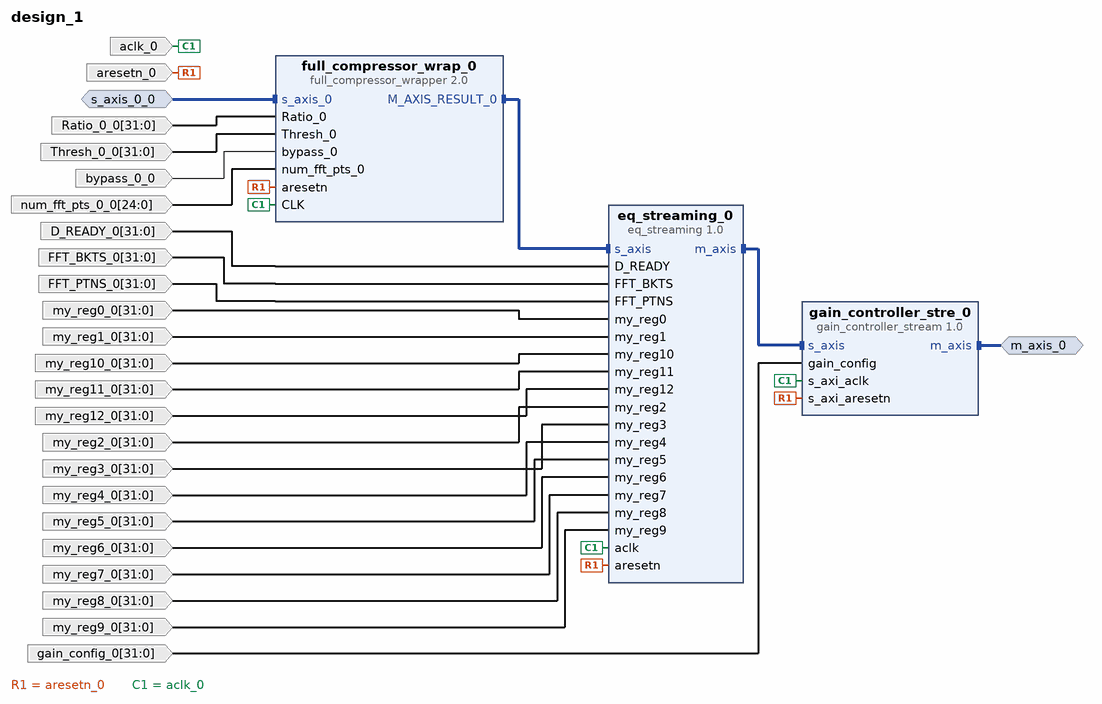
[diagram p0: block diagram of the top level]
# Vivado block design design_1, xc7z020clg484-1, Vivado 2020.2
create_bd_design design_1

create_bd_intf_port -mode Slave -vlnv xilinx.com:interface:axis_rtl:1.0 s_axis_0_0
set_property -dict [list \
  CONFIG.HAS_TKEEP 0 \
  CONFIG.HAS_TLAST 0 \
  CONFIG.HAS_TREADY 1 \
  CONFIG.HAS_TSTRB 0 \
  CONFIG.LAYERED_METADATA undef \
  CONFIG.TDATA_NUM_BYTES 4 \
  CONFIG.TDEST_WIDTH 0 \
  CONFIG.TID_WIDTH 0 \
  CONFIG.TUSER_WIDTH 0 \
] [get_bd_intf_ports s_axis_0_0]
create_bd_intf_port -mode Master -vlnv xilinx.com:interface:axis_rtl:1.0 m_axis_0
create_bd_port -dir I -type rst aresetn_0
create_bd_port -dir I -type clk aclk_0
create_bd_port -dir I -from 31 -to 0 Ratio_0_0
create_bd_port -dir I -from 31 -to 0 Thresh_0_0
create_bd_port -dir I bypass_0_0
create_bd_port -dir I -from 24 -to 0 num_fft_pts_0_0
create_bd_port -dir I -from 31 -to 0 D_READY_0
create_bd_port -dir I -from 31 -to 0 FFT_BKTS_0
create_bd_port -dir I -from 31 -to 0 FFT_PTNS_0
create_bd_port -dir I -from 31 -to 0 my_reg0_0
create_bd_port -dir I -from 31 -to 0 my_reg1_0
create_bd_port -dir I -from 31 -to 0 my_reg10_0
create_bd_port -dir I -from 31 -to 0 my_reg11_0
create_bd_port -dir I -from 31 -to 0 my_reg12_0
create_bd_port -dir I -from 31 -to 0 my_reg2_0
create_bd_port -dir I -from 31 -to 0 my_reg3_0
create_bd_port -dir I -from 31 -to 0 my_reg4_0
create_bd_port -dir I -from 31 -to 0 my_reg5_0
create_bd_port -dir I -from 31 -to 0 my_reg6_0
create_bd_port -dir I -from 31 -to 0 my_reg7_0
create_bd_port -dir I -from 31 -to 0 my_reg8_0
create_bd_port -dir I -from 31 -to 0 my_reg9_0
create_bd_port -dir I -from 31 -to 0 gain_config_0

create_bd_cell -type ip -vlnv sfu.ca:user:full_compressor_wrapper:2.0 full_compressor_wrap_0
create_bd_cell -type ip -vlnv sfu.ca:user:gain_controller_stream:1.0 gain_controller_stre_0
create_bd_cell -type ip -vlnv sfu.ca:user:eq_streaming:1.0 eq_streaming_0

# ---- connections ----

connect_bd_intf_net [get_bd_intf_pins full_compressor_wrap_0/M_AXIS_RESULT_0] [get_bd_intf_pins eq_streaming_0/s_axis]
connect_bd_intf_net [get_bd_intf_pins eq_streaming_0/m_axis] [get_bd_intf_pins gain_controller_stre_0/s_axis]
connect_bd_intf_net -intf_net s_axis_0_0_1 [get_bd_intf_ports s_axis_0_0] [get_bd_intf_pins full_compressor_wrap_0/s_axis_0]
connect_bd_intf_net [get_bd_intf_ports m_axis_0] [get_bd_intf_pins gain_controller_stre_0/m_axis]
connect_bd_net -net aresetn_0_1 [get_bd_ports aresetn_0] \
  [get_bd_pins full_compressor_wrap_0/aresetn] [get_bd_pins gain_controller_stre_0/s_axi_aresetn] \
  [get_bd_pins eq_streaming_0/aresetn]
connect_bd_net -net aclk_0_1 [get_bd_ports aclk_0] \
  [get_bd_pins gain_controller_stre_0/s_axi_aclk] [get_bd_pins full_compressor_wrap_0/CLK] [get_bd_pins eq_streaming_0/aclk]
connect_bd_net -net Ratio_0_0_1 [get_bd_ports Ratio_0_0] [get_bd_pins full_compressor_wrap_0/Ratio_0]
connect_bd_net -net Thresh_0_0_1 [get_bd_ports Thresh_0_0] [get_bd_pins full_compressor_wrap_0/Thresh_0]
connect_bd_net -net bypass_0_0_1 [get_bd_ports bypass_0_0] [get_bd_pins full_compressor_wrap_0/bypass_0]
connect_bd_net -net num_fft_pts_0_0_1 [get_bd_ports num_fft_pts_0_0] [get_bd_pins full_compressor_wrap_0/num_fft_pts_0]
connect_bd_net -net D_READY_0_1 [get_bd_ports D_READY_0] [get_bd_pins eq_streaming_0/D_READY]
connect_bd_net -net FFT_BKTS_0_1 [get_bd_ports FFT_BKTS_0] [get_bd_pins eq_streaming_0/FFT_BKTS]
connect_bd_net -net FFT_PTNS_0_1 [get_bd_ports FFT_PTNS_0] [get_bd_pins eq_streaming_0/FFT_PTNS]
connect_bd_net -net my_reg0_0_1 [get_bd_ports my_reg0_0] [get_bd_pins eq_streaming_0/my_reg0]
connect_bd_net -net my_reg1_0_1 [get_bd_ports my_reg1_0] [get_bd_pins eq_streaming_0/my_reg1]
connect_bd_net -net my_reg10_0_1 [get_bd_ports my_reg10_0] [get_bd_pins eq_streaming_0/my_reg10]
connect_bd_net -net my_reg11_0_1 [get_bd_ports my_reg11_0] [get_bd_pins eq_streaming_0/my_reg11]
connect_bd_net -net my_reg12_0_1 [get_bd_ports my_reg12_0] [get_bd_pins eq_streaming_0/my_reg12]
connect_bd_net -net my_reg2_0_1 [get_bd_ports my_reg2_0] [get_bd_pins eq_streaming_0/my_reg2]
connect_bd_net -net my_reg3_0_1 [get_bd_ports my_reg3_0] [get_bd_pins eq_streaming_0/my_reg3]
connect_bd_net -net my_reg4_0_1 [get_bd_ports my_reg4_0] [get_bd_pins eq_streaming_0/my_reg4]
connect_bd_net -net my_reg5_0_1 [get_bd_ports my_reg5_0] [get_bd_pins eq_streaming_0/my_reg5]
connect_bd_net -net my_reg6_0_1 [get_bd_ports my_reg6_0] [get_bd_pins eq_streaming_0/my_reg6]
connect_bd_net -net my_reg7_0_1 [get_bd_ports my_reg7_0] [get_bd_pins eq_streaming_0/my_reg7]
connect_bd_net -net my_reg8_0_1 [get_bd_ports my_reg8_0] [get_bd_pins eq_streaming_0/my_reg8]
connect_bd_net -net my_reg9_0_1 [get_bd_ports my_reg9_0] [get_bd_pins eq_streaming_0/my_reg9]
connect_bd_net -net gain_config_0_1 [get_bd_ports gain_config_0] [get_bd_pins gain_controller_stre_0/gain_config]

validate_bd_design
save_bd_design
